# EAGLE design TPS92638 - Breakoutv1.3 (EAGLE 7.7.0)
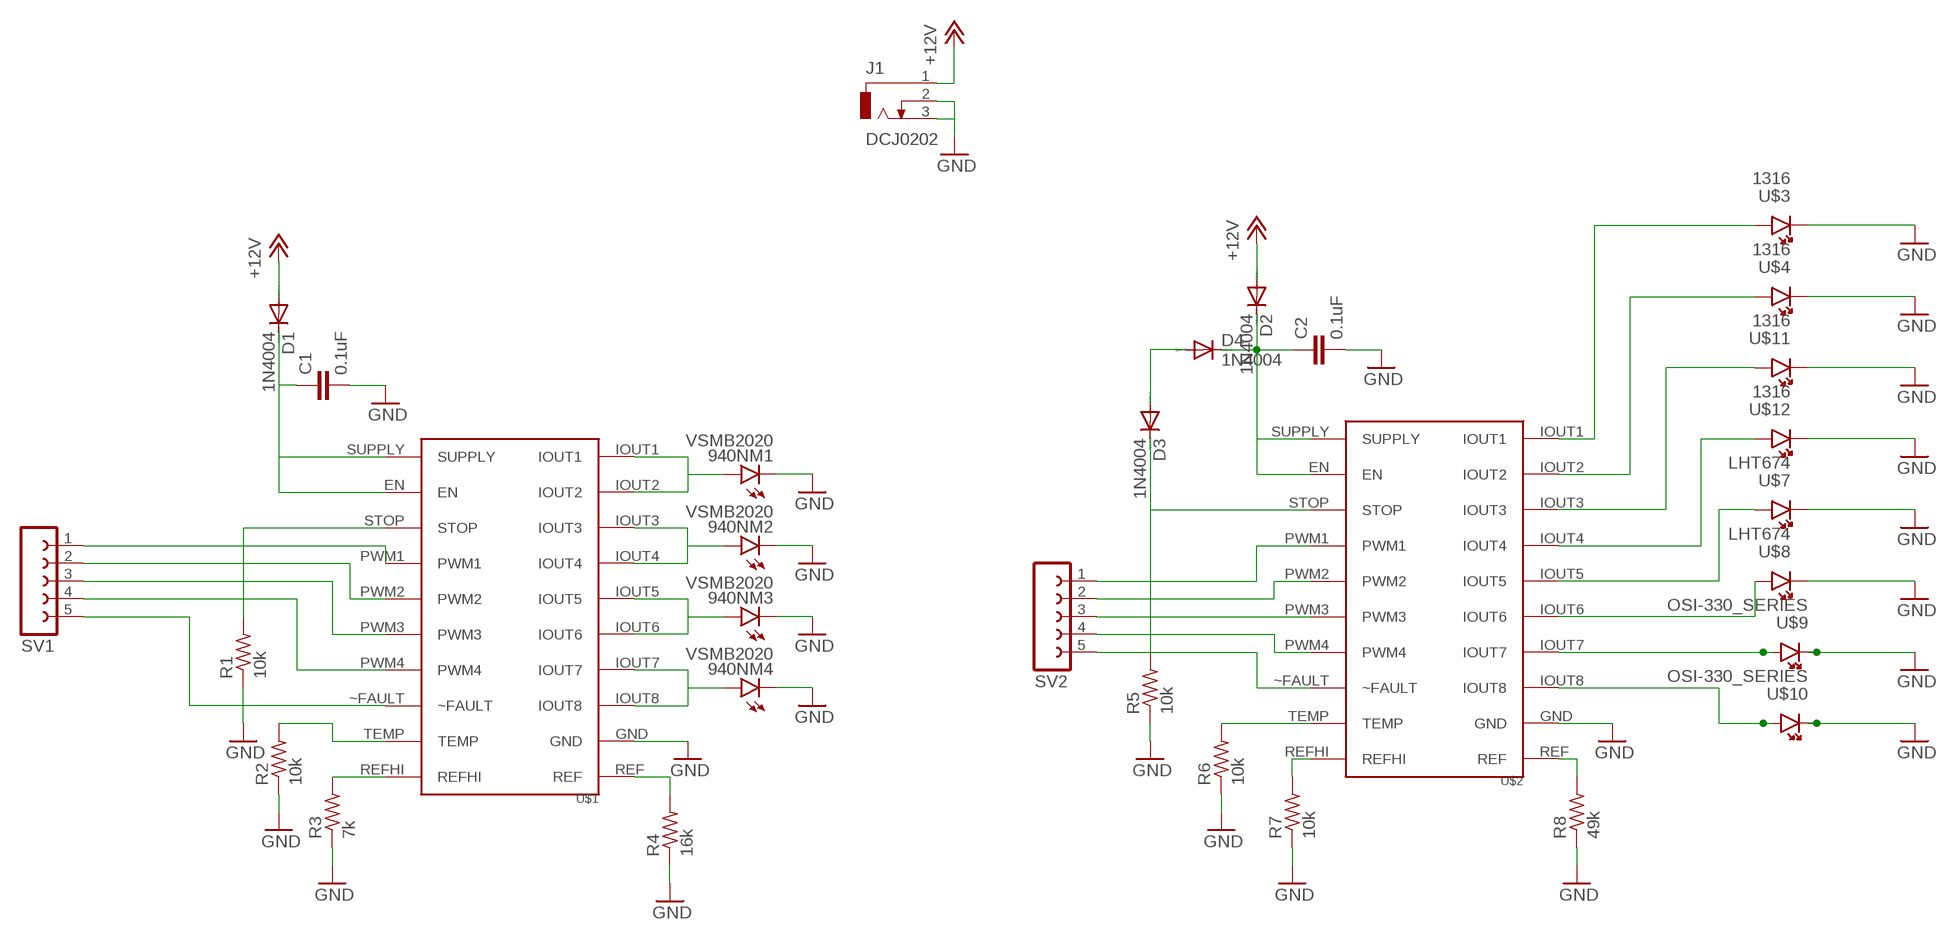
[diagram p0: schematic, sheet 1]

## Parts
940NM1  VSMB2020  [GULLWING-2.3MM]
940NM2  VSMB2020  [GULLWING-2.3MM]
940NM3  VSMB2020  [GULLWING-2.3MM]
940NM4  VSMB2020  [GULLWING-2.3MM]
C1  0.1uF  CAP  [CAP]
C2  0.1uF  CAP  [CAP]
D1  1N4004  1N4148DO35-7  [DO35-7]
D2  1N4004  1N4148DO35-7  [DO35-7]
D3  1N4004  1N4148DO35-7  [DO35-7]
D4  1N4004  1N4148DO35-7  [DO35-7]
J1  DCJ0202  [DCJ0202]
R1  10k  LED  [LED]
R2  10k  LED  [LED]
R3  7k  LED  [LED]
R4  16k  LED  [LED]
R5  10k  LED  [LED]
R6  10k  LED  [LED]
R7  10k  LED  [LED]
R8  49k  LED  [LED]
SV1  FE05-1  [FE05-1]
SV2  FE05-1  [FE05-1]
U$1  TPS92638  [TPS92638]
U$2  TPS92638  [TPS92638]
U$3  1316  [1316]
U$4  1316  [1316]
U$7  LHT674  [LHT674]
U$8  LHT674  [LHT674]
U$9  OSI-330_SERIES  [OSI-330_SERIES]
U$10  OSI-330_SERIES  [OSI-330_SERIES]
U$11  1316  [1316]
U$12  1316  [1316]

## Nets
+12V: D1.A D2.A J1.1
C: C1.1 D1.C U$1.EN U$1.SUPPLY
GND: 940NM1.P$2(C) 940NM2.P$2(C) 940NM3.P$2(C) 940NM4.P$2(C) C1.2 C2.2 J1.2 J1.3 R1.1 R2.1 R3.1 R4.1 R5.1 R6.1 R7.1 R8.1 U$1.GND U$2.GND U$3.CATHODE U$4.CATHODE U$7.CATHODE U$8.CATHODE U$9.CATHODE U$10.CATHODE U$11.CATHODE U$12.CATHODE
N$1: SV1.1 U$1.PWM1
N$2: SV1.2 U$1.PWM2
N$3: SV1.3 U$1.PWM3
N$4: SV1.4 U$1.PWM4
N$5: R1.2 U$1.STOP
N$6: SV2.1 U$2.PWM1
N$7: SV2.2 U$2.PWM2
N$8: SV2.3 U$2.PWM3
N$9: SV2.4 U$2.PWM4
N$10: D3.C R5.2 U$2.STOP
N$11: R3.2 U$1.REFHI
N$12: R2.2 U$1.TEMP
N$13: R4.2 U$1.REF
N$14: R6.2 U$2.TEMP
N$15: R7.2 U$2.REFHI
N$16: R8.2 U$2.REF
N$17: SV1.5 U$1.~FAULT
N$18: C2.1 D2.C D4.C U$2.EN U$2.SUPPLY
N$19: 940NM1.P$1(A) U$1.IOUT1 U$1.IOUT2
N$20: 940NM2.P$1(A) U$1.IOUT3 U$1.IOUT4
N$21: U$2.IOUT1 U$3.ANODE
N$22: 940NM3.P$1(A) U$1.IOUT5 U$1.IOUT6
N$23: 940NM4.P$1(A) U$1.IOUT7 U$1.IOUT8
N$24: U$2.IOUT2 U$4.ANODE
N$25: U$2.IOUT3 U$11.ANODE
N$26: U$2.IOUT4 U$12.ANODE
N$27: U$2.IOUT5 U$7.ANODE
N$28: U$2.IOUT6 U$8.ANODE
N$29: U$2.IOUT7 U$9.ANODE
N$30: U$2.IOUT8 U$10.ANODE
N$33: SV2.5 U$2.~FAULT
N$34: D3.A D4.A

## Library data of the parts
940NM1-940NM4 = VS:VSMB2020: VSMB2020X01 - ir led (940nm) in 2.3mm gullwing footprint from Vishay.
C1 C2 = CAP(80mil):CAP
D1-D4 = diode:1N4148: DIODE high speed (Philips)
J1 = con-jack:DCJ0202: DC POWER JACK Source: DCJ0202.pdf; OC_FARNELL: unknown; OC_NEWARK: unknown
R1-R8 = LED(80mil):LED
SV1 SV2 = con-lsta:FE05-1: FEMALE HEADER; OC_FARNELL: unknown; OC_NEWARK: unknown
U$1 U$2 = TPS92638-Q1:TPS92638: The TPS92638-Q1 is an eight-channel linear LED driver with PWM dimming control.
U$3 U$4 U$11 U$12 = 1316:1316: Flex-System, THT LED’s. The housing is designed to accommodate Ø2mm light guides, i.e. 2000μm fibers and on request 1000μm fibers with a black coating are used.
U$7 U$8 = LHT674:LHT674: TOPLED, SMT LED with integrated reflector. With our great experience in SMT LED we are able to offer a high quality product for all kind of applications.
U$9 U$10 = OSI-330_series:OSI-330_SERIES: Series 330 - 1206 with Lens IR high intensity 660-850 nm

## Board
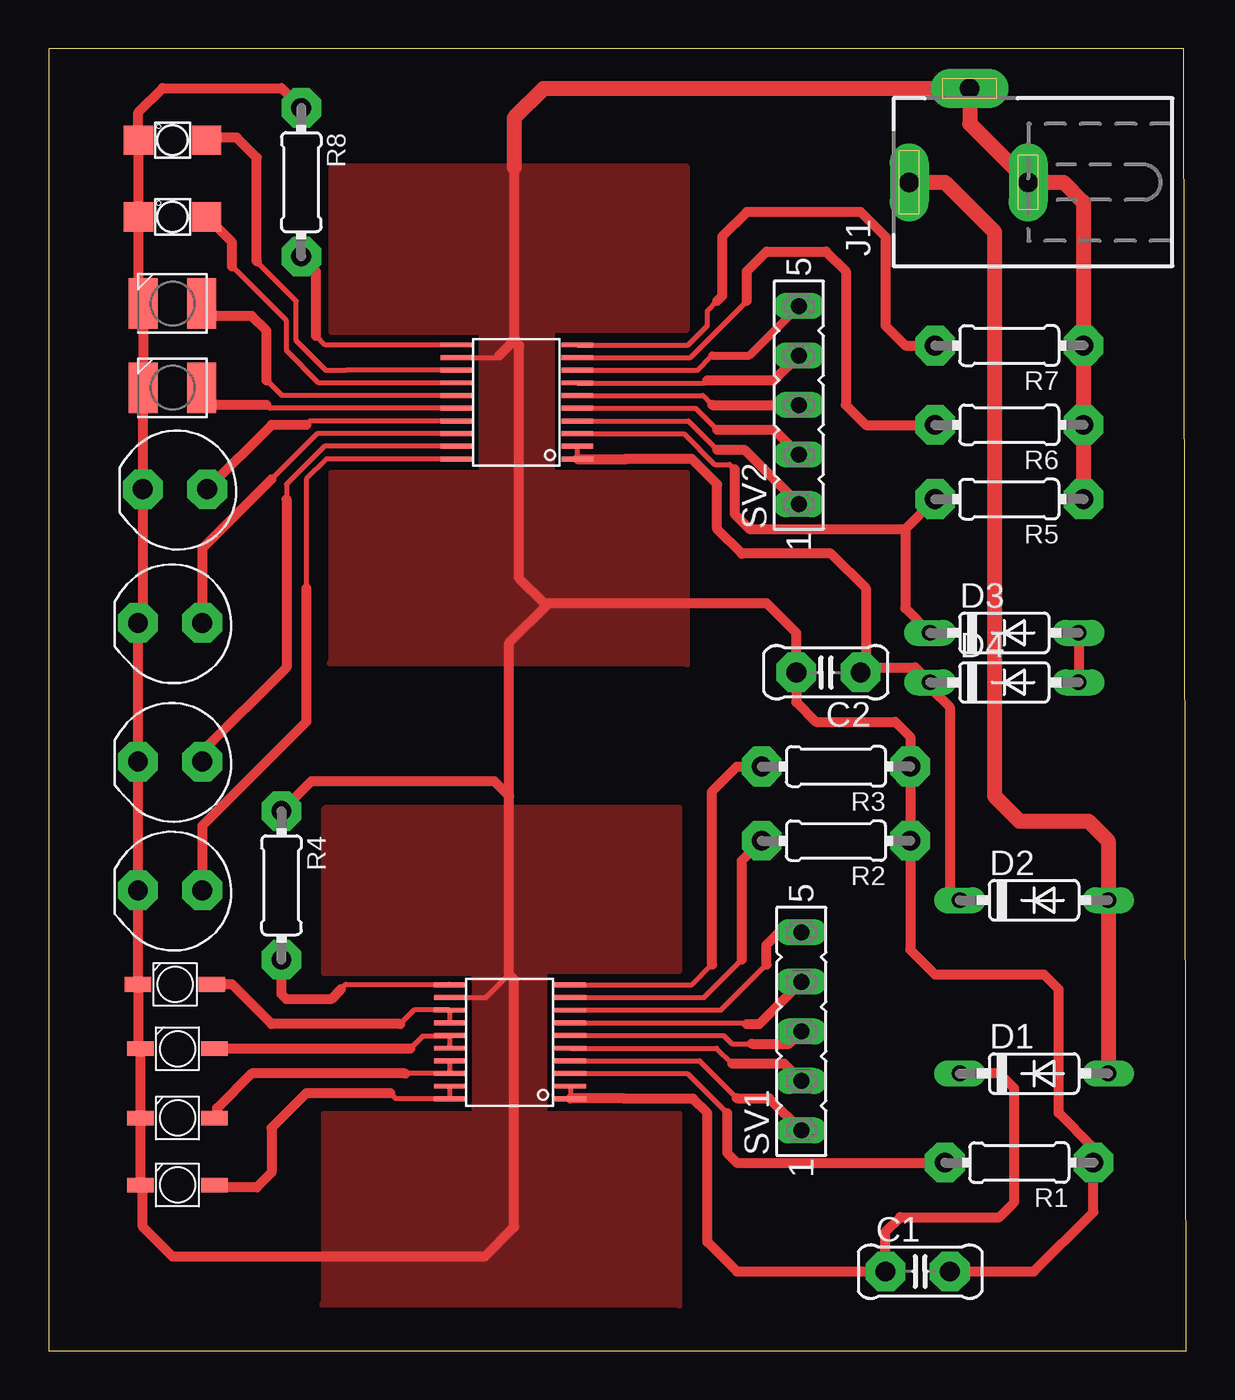
[diagram p1: board, top side]

Size 58.34 x 66.79 mm. Coordinates in mm from the lower left corner, seen from the top.
Outline: 0,0 58.34,0 58.22,66.79 0,66.79 0,0
Copper layers (1*16): Top 0.035mm / dielectric 1.5mm / Bottom 0.035mm
Design rules "default": minimum track width 10mil, minimum drill 24mil, track to track 8mil, track to pad 8mil, pad to pad 8mil, via to via 8mil, smd to smd 8mil, copper to edge 40mil, drill to drill 8mil, minimum pad ring 10mil, minimum via ring 8mil, stop-mask expansion 4mil, vias tented up to drill 0mil, thermal gap 10mil

### Footprints (pad centres in the part's own frame; a part is rotated, then mirrored left to right if it is on the bottom)
GULLWING-2.3MM = smd 1.35 x 0.75: P$1 -1.9,0; P$2 1.9,0
CAP = drill 1.016 pad 2.032 octagon: 1 -1.778,0; 2 1.524,0
DO35-7 = drill 0.813 long: A 3.81,0; C -3.81,0
DCJ0202 = drill 1 pad 2 long: 1 0,3.1; 2 4.8,0; 3 0,-3
LED = drill 1.016 pad 2.032 octagon: 1 -3.81,0; 2 3.81,0
FE05-1 = drill 0.813 long: 1 -5.08,0; 2 -2.54,0; 3 0,0; 4 2.54,0; 5 5.08,0
TPS92638 = smd 0.25 x 1.6: EN -2.25,-3.1; GND 2.3,3.1; IOUT1 -2.9,3.1; IOUT2 -2.25,3.1; IOUT3 -1.6,3.1; IOUT4 -0.95,3.1; IOUT5 -0.3,3.1; IOUT6 0.35,3.1; IOUT7 1,3.1; IOUT8 1.65,3.1; PWM1 -0.95,-3.1; PWM2 -0.3,-3.1; PWM3 0.35,-3.1; PWM4 1,-3.1; REF 2.95,3.1; REFHI 2.95,-3.1; STOP -1.6,-3.1; SUPPLY -2.9,-3.1; TEMP 2.3,-3.1; ~FAULT 1.65,-3.1
1316 = drill 1.016 pad 2.032 octagon: ANODE -1.778,0; CATHODE 1.524,0
LHT674 = smd 1.5 x 2.6: ANODE -1.5,0; CATHODE 1.5,0
OSI-330_SERIES = smd 1.5 x 1.5: ANODE -1.75,0; CATHODE 1.75,0

### Placement (x,y rotation side)
940NM1  6.6,8.51 180 top
940NM2  6.6,11.94 180 top
940NM3  6.6,15.49 180 top
940NM4  6.48,18.8 180 top
C1  44.7,4.06 0 top
C2  39.88,34.8 180 top
D1  50.55,14.22 0 top
D2  50.55,23.11 0 top
D3  49.02,36.83 0 top
D4  49.02,34.29 0 top
J1  47.24,59.94 90 top
R1  49.78,9.65 180 top
R2  40.39,26.16 180 top
R3  40.39,29.97 180 top
R4  11.94,23.88 270 top
R5  49.28,43.69 180 top
R6  49.28,47.5 180 top
R7  49.28,51.56 180 top
R8  12.95,59.94 270 top
SV1  38.61,16.38 90 top
SV2  38.48,48.51 90 top
U$1  23.66,15.82 90 top
U$2  24.01,48.65 90 top
U$3  6.1,23.62 180 top
U$4  6.1,30.23 180 top
U$7  6.35,49.4 180 top
U$8  6.35,53.72 180 top
U$9  6.35,58.17 180 top
U$10  6.35,62.1 180 top
U$11  6.1,37.34 180 top
U$12  6.35,44.2 180 top

### Tracks (layer width: path | path; a pad name or v marks a point on that pad's centre or on a via)
+12V
  Top 0.762: J1.1 45.97,59.94 48.51,57.4 48.51,28.45 49.78,27.18 53.34,27.18 54.36,26.16 D2.A D1.A
C
  Top 0.254: U$1.EN U$1.SUPPLY
  Top 0.508: U$1.SUPPLY 26.79,12.95 29.46,12.95 29.49,12.92 33.05,12.92 33.78,12.19 33.78,5.59 35.31,4.06 C1.1 42.93,6.1 43.69,6.86 48.77,6.86 49.53,7.62 49.53,13.46 48.77,14.22 D1.C
GND
  Top 0.254: U$2.GND 23.01,50.95 23.11,51.05 | U$1.GND 22.44,18.12 23.62,19.3
  Top 0.508: 23.62,28.45 23.62,19.3 23.88,19.05 23.88,6.35 22.35,4.83 6.35,4.83 4.83,6.35 4.83,8.39 940NM1.P$2 940NM2.P$2 940NM3.P$2 4.58,15.62 940NM4.P$2 U$3.CATHODE U$4.CATHODE U$11.CATHODE 4.83,37.59 U$12.CATHODE 4.83,49.4 U$7.CATHODE | 23.62,28.45 22.86,29.21 13.46,29.21 R4.1 | 23.88,51.82 24.13,51.56 24.13,39.62 25.4,38.35 25.65,38.35 | 4.83,52.58 4.6,52.8 U$9.CATHODE U$10.CATHODE 4.6,63.53 5.84,64.77 11.94,64.77 R8.1 | 4.83,52.58 4.83,53.7 U$8.CATHODE | 25.65,38.35 36.83,38.35 38.35,36.83 C2.2 38.35,33.27 39.37,32.26 43.43,32.26 44.2,31.5 R3.1 R2.1 44.2,20.57 45.47,19.3 51.05,19.3 51.82,18.54 51.82,12.19 53.59,10.41 R1.1 53.59,7.11 50.55,4.06 C1.2 | 23.88,60.71 23.88,51.82 | 23.88,51.82 23.11,51.05 | 4.83,52.58 4.85,52.58 U$7.CATHODE | U$7.CATHODE 5.08,49.4 | 23.62,28.45 23.62,36.32 25.65,38.35
  Top 0.762: 23.88,60.71 23.88,63.25 25.37,64.74 J1.2 47.24,62.94 J1.3 52.07,59.94 53.09,58.93 R7.1 R6.1 R5.1
  pour Top: 22.19,52.26 22.19,45.06 14.46,45.06 14.46,35.36 14.36,35.26 32.66,35.26 32.76,35.16 32.76,45.06 25.84,45.06 25.84,52.36 32.76,52.36 32.76,60.76 14.56,60.76 14.46,60.66 14.46,52.26
  pour Top: 21.81,19.37 21.81,12.17 14.08,12.17 14.08,2.47 13.98,2.37 32.28,2.37 32.38,2.27 32.38,12.17 25.46,12.17 25.46,19.47 32.38,19.47 32.38,27.87 14.18,27.87 14.08,27.77 14.08,19.37
N$1
  Top 0.254: U$1.PWM1 33.39,14.87 35.31,12.95
  Top 0.508: 35.31,12.95 36.96,12.95 SV1.1
N$2
  Top 0.254: U$1.PWM2 34.26,15.52 35.05,14.73
  Top 0.508: 35.05,14.73 37.72,14.73 SV1.2
N$3
  Top 0.254: U$1.PWM3 34.63,16.17 35.05,15.75 36.07,15.75
  Top 0.508: 36.07,15.75 37.97,15.75 SV1.3
N$4
  Top 0.254: U$1.PWM4 35.75,16.82 35.81,16.76
  Top 0.508: 35.81,16.76 36.45,16.76 SV1.4
N$5
  Top 0.254: U$1.STOP 32.77,14.22 34.8,12.19
  Top 0.508: R1.2 35.31,9.65 34.8,10.16 34.8,12.19
N$6
  Top 0.254: U$2.PWM1 32.82,47.7 34.29,46.23
  Top 0.508: SV2.1 35.69,46.23 34.29,46.23
N$7
  Top 0.254: U$2.PWM2 33.19,48.35 34.29,47.24
  Top 0.508: 34.29,47.24 37.21,47.24 SV2.2
N$8
  Top 0.254: U$2.PWM3 33.55,49 34.04,48.51
  Top 0.508: 34.04,48.51 SV2.3
N$9
  Top 0.254: U$2.PWM4 33.65,49.65 33.78,49.78
  Top 0.508: 33.78,49.78 37.21,49.78 SV2.4
N$10
  Top 0.254: U$2.STOP 32.58,47.05 34.16,45.47 34.92,45.47 35.18,45.21
  Top 0.508: 35.18,45.21 35.18,42.93 35.94,42.16 43.94,42.16 | 43.94,42.16 R5.2 | 43.94,42.16 43.94,38.1 D3.C
N$11
  Top 0.254: U$1.REFHI 33,18.77 34.04,19.81
  Top 0.508: 34.04,19.81 34.04,28.7 35.31,29.97 R3.2
N$12
  Top 0.254: U$1.TEMP 33.62,18.12 35.56,20.07
  Top 0.508: 35.56,20.07 35.56,25.15 R2.2
N$13
  Top 0.254: 14.99,18.54 15.24,18.8 20.54,18.8 U$1.REF
  Top 0.508: 14.99,18.54 14.48,18.03 12.19,18.03 11.94,18.29 R4.2
N$14
  Top 0.254: U$2.TEMP 32.91,50.95 35.81,53.85 35.81,54.86
  Top 0.508: 35.81,53.85 35.81,55.37 36.83,56.39 39.88,56.39 40.89,55.37 40.89,48.51 41.91,47.5 R6.2
N$15
  Top 0.254: U$2.REFHI 32.8,51.6 33.78,52.58 33.78,53.34 34.29,53.85
  Top 0.508: 34.29,53.85 34.54,54.1 34.54,57.15 35.81,58.42 41.66,58.42 42.93,57.15 42.93,52.58 43.94,51.56 R7.2
N$16
  Top 0.254: U$2.REF 14.19,51.6 13.72,52.07
  Top 0.508: 13.72,52.07 13.72,55.37 R8.2
N$17
  Top 0.254: U$1.~FAULT 34.49,17.47 36.83,19.81
  Top 0.508: 36.83,19.81 36.83,20.83 37.59,21.59 38.48,21.59 SV1.5
N$18
  Top 0.254: U$2.EN U$2.SUPPLY
  Top 0.508: U$2.SUPPLY 29.59,45.75 29.59,45.72 29.62,45.75 32.99,45.75 34.29,44.45 34.29,42.16 35.56,40.89 40.13,40.89 41.91,39.12 41.91,35.05 | 41.91,35.05 C2.1 | 41.91,35.05 44.45,35.05 D4.C 45.21,34.04 46.23,33.02 46.23,23.62 D2.C
N$19
  Top 0.254: U$1.IOUT2 U$1.IOUT1 17.81,12.92 17.53,13.21
  Top 0.508: 17.53,13.21 13.21,13.21 11.43,11.43 11.43,9.14 10.67,8.38 8.63,8.38 940NM1.P$1
N$20
  Top 0.254: U$1.IOUT4 U$1.IOUT3 18.29,14.22
  Top 0.508: 18.29,14.22 10.41,14.22 8.64,12.45 8.64,12.07 940NM2.P$1
N$21
  Top 0.254: U$2.IOUT1 14.25,45.75 13.21,44.7 13.21,39.12
  Top 0.508: 13.21,39.12 13.21,32.26 7.87,26.92 U$3.ANODE
N$22
  Top 0.254: U$1.IOUT5 U$1.IOUT6 20.52,16.13 19.18,16.13 18.54,15.49
  Top 0.508: 18.54,15.49 940NM3.P$1
N$23
  Top 0.254: U$1.IOUT7 U$1.IOUT8 18.74,17.47 18.03,16.76
  Top 0.508: 18.03,16.76 11.43,16.76 9.4,18.8 940NM4.P$1
N$24
  Top 0.254: U$2.IOUT2 14.14,46.4 12.19,44.45 12.19,43.69
  Top 0.508: 12.19,43.69 12.19,35.05 7.87,30.73 U$4.ANODE
N$25
  Top 0.254: U$2.IOUT3 13.78,47.05 11.43,44.7
  Top 0.508: 11.43,44.7 7.87,41.15 U$11.ANODE
N$26
  Top 0.254: U$2.IOUT4 13.41,47.7 13.21,47.5
  Top 0.508: 13.21,47.5 11.43,47.5 U$12.ANODE
N$27
  Top 0.254: U$2.IOUT5 11.34,48.35 11.18,48.51
  Top 0.508: 11.18,48.51 7.72,48.51 U$7.ANODE
N$28
  Top 0.254: U$2.IOUT6 11.96,49 11.18,49.78
  Top 0.508: U$8.ANODE 8.48,53.09 10.41,53.09 11.18,52.32 11.18,49.78
N$29
  Top 0.254: U$2.IOUT7 13.85,49.65 12.19,51.31 12.19,52.83 9.4,55.63
  Top 0.508: 9.4,55.63 9.4,56.87 U$9.ANODE
N$30
  Top 0.254: U$2.IOUT8 15.25,50.3 15.24,50.29 14.22,50.29 12.7,51.82 12.7,53.85 10.67,55.88
  Top 0.508: 10.67,55.88 10.67,61.21 9.65,62.23 8.23,62.23 U$10.ANODE
N$33
  Top 0.254: U$2.~FAULT 33.27,50.29 34.04,51.05
  Top 0.406: 34.04,51.05 35.94,51.05 SV2.5
N$34
  Top 0.508: D3.A D4.A